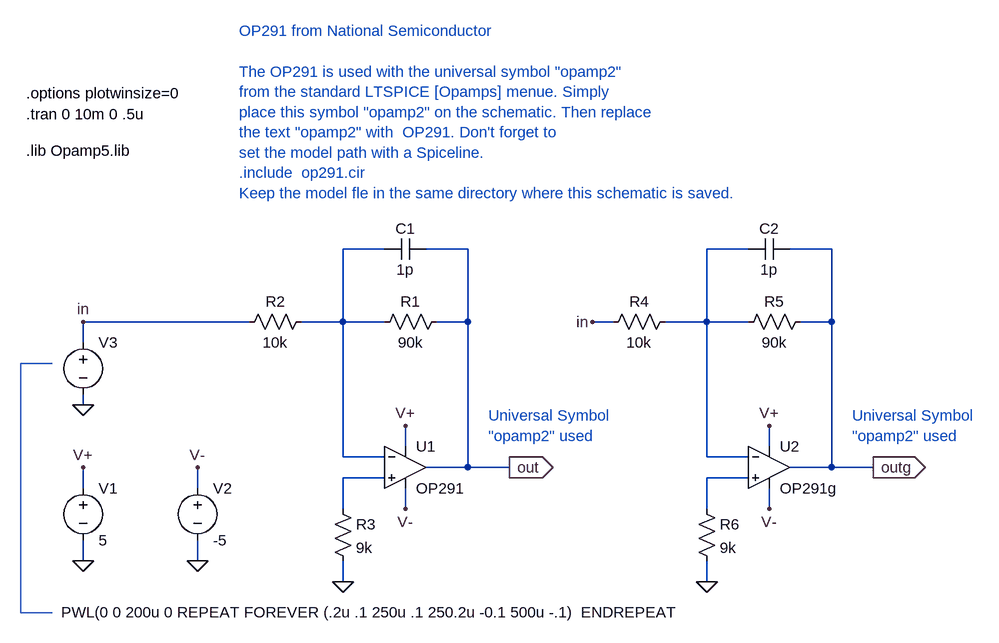
[diagram p0: schematic OP291_test.asc]
OP291_test.asc, the LTspice schematic file:
Version 4
SHEET 1 1428 1172
WIRE 96 -128 32 -128
WIRE 224 -128 160 -128
WIRE 656 -128 592 -128
WIRE 784 -128 720 -128
WIRE -112 -16 -368 -16
WIRE 32 -16 32 -128
WIRE 32 -16 -32 -16
WIRE 96 -16 32 -16
WIRE 224 -16 224 -128
WIRE 224 -16 176 -16
WIRE 448 -16 416 -16
WIRE 592 -16 592 -128
WIRE 592 -16 528 -16
WIRE 656 -16 592 -16
WIRE 784 -16 784 -128
WIRE 784 -16 736 -16
WIRE -368 16 -368 -16
WIRE -368 112 -368 96
WIRE 128 176 128 144
WIRE 688 176 688 144
WIRE 32 192 32 -16
WIRE 96 192 32 192
WIRE 592 192 592 -16
WIRE 656 192 592 192
WIRE 224 208 224 -16
WIRE 224 208 160 208
WIRE 288 208 224 208
WIRE 784 208 784 -16
WIRE 784 208 720 208
WIRE 848 208 784 208
WIRE 96 224 32 224
WIRE 656 224 592 224
WIRE -368 240 -368 208
WIRE -192 240 -192 208
WIRE 32 272 32 224
WIRE 128 272 128 240
WIRE 592 272 592 224
WIRE 688 272 688 240
WIRE -368 352 -368 320
WIRE -192 352 -192 320
WIRE 32 384 32 352
WIRE 592 384 592 352
FLAG -368 352 0
FLAG -368 112 0
FLAG 288 208 out
IOPIN 288 208 Out
FLAG -368 -16 in
FLAG 128 144 V+
FLAG -368 208 V+
FLAG 32 384 0
FLAG -192 352 0
FLAG -192 208 V-
FLAG 128 272 V-
FLAG 848 208 outg
IOPIN 848 208 Out
FLAG 688 144 V+
FLAG 592 384 0
FLAG 688 272 V-
FLAG 416 -16 in
SYMBOL voltage -368 224 R0
WINDOW 123 0 0 Left 0
WINDOW 39 0 0 Left 0
SYMATTR InstName V1
SYMATTR Value 5
SYMBOL res -16 -32 R90
WINDOW 0 0 56 VBottom 0
WINDOW 3 32 56 VTop 0
SYMATTR InstName R2
SYMATTR Value 10k
SYMBOL voltage -368 0 R0
WINDOW 3 -34 431 Left 0
WINDOW 123 0 0 Left 0
WINDOW 39 0 0 Left 0
SYMATTR Value PWL(0 0 200u 0 REPEAT FOREVER (.2u .1 250u .1 250.2u -0.1 500u -.1)  ENDREPEAT
SYMATTR InstName V3
SYMBOL cap 160 -144 R90
WINDOW 0 0 32 VBottom 0
WINDOW 3 32 32 VTop 0
SYMATTR InstName C1
SYMATTR Value 1p
SYMBOL res 192 -32 R90
WINDOW 0 0 56 VBottom 0
WINDOW 3 32 56 VTop 0
SYMATTR InstName R1
SYMATTR Value 90k
SYMBOL opamp2 128 144 R0
SYMATTR InstName U1
SYMATTR Value OP291
SYMBOL res 16 256 R0
SYMATTR InstName R3
SYMATTR Value 9k
SYMBOL voltage -192 224 R0
WINDOW 123 0 0 Left 0
WINDOW 39 0 0 Left 0
SYMATTR InstName V2
SYMATTR Value -5
SYMBOL res 544 -32 R90
WINDOW 0 0 56 VBottom 0
WINDOW 3 32 56 VTop 0
SYMATTR InstName R4
SYMATTR Value 10k
SYMBOL cap 720 -144 R90
WINDOW 0 0 32 VBottom 0
WINDOW 3 32 32 VTop 0
SYMATTR InstName C2
SYMATTR Value 1p
SYMBOL res 752 -32 R90
WINDOW 0 0 56 VBottom 0
WINDOW 3 32 56 VTop 0
SYMATTR InstName R5
SYMATTR Value 90k
SYMBOL opamp2 688 144 R0
SYMATTR InstName U2
SYMATTR Value OP291g
SYMBOL res 576 256 R0
SYMATTR InstName R6
SYMATTR Value 9k
TEXT -456 -336 Left 0 !.tran 0 10m 0 .5u
TEXT 256 128 Left 0 ;Universal Symbol \n"opamp2" used
TEXT -128 -464 Left 0 ;OP291 from National Semiconductor\n \nThe OP291 is used with the universal symbol "opamp2" \nfrom the standard LTSPICE [Opamps] menue. Simply\nplace this symbol "opamp2" on the schematic. Then replace\nthe text "opamp2" with  OP291. Don't forget to \nset the model path with a Spiceline.\n.include  op291.cir\nKeep the model fle in the same directory where this schematic is saved.
TEXT -456 -368 Left 0 !.options plotwinsize=0
TEXT -456 -280 Left 0 !.lib Opamp5.lib
TEXT 816 128 Left 0 ;Universal Symbol \n"opamp2" used
LINE Normal -464 48 -416 48
LINE Normal -464 432 -464 48
LINE Normal -416 432 -464 432

The netlist it stands for:
* OP291_test.asc
V1 V+ 0 5
R2 N001 in 10k
V3 in 0 PWL(0 0 200u 0 REPEAT FOREVER (.2u .1 250u .1 250.2u -0.1 500u -.1)  ENDREPEAT
C1 out N001 1p
R1 out N001 90k
XU1 N003 N001 V+ V- out OP291  ; pins In+ In- V+ V- OUT
R3 N003 0 9k
V2 V- 0 -5
R4 N002 in 10k
C2 outg N002 1p
R5 outg N002 90k
XU2 N004 N002 V+ V- outg OP291g  ; pins In+ In- V+ V- OUT
R6 N004 0 9k
.tran 0 10m 0 .5u
* Universal Symbol
* "opamp2" used
* OP291 from National Semiconductor
* The OP291 is used with the universal symbol "opamp2"
* from the standard LTSPICE [Opamps] menue. Simply
* place this symbol "opamp2" on the schematic. Then replace
* the text "opamp2" with  OP291. Don't forget to
* set the model path with a Spiceline.
* .include  op291.cir
* Keep the model fle in the same directory where this schematic is saved.
.options plotwinsize=0
.lib Opamp5.lib
* Universal Symbol
* "opamp2" used
.backanno
.end